# EAGLE schematic usblighteagle (EAGLE 6.5.0)
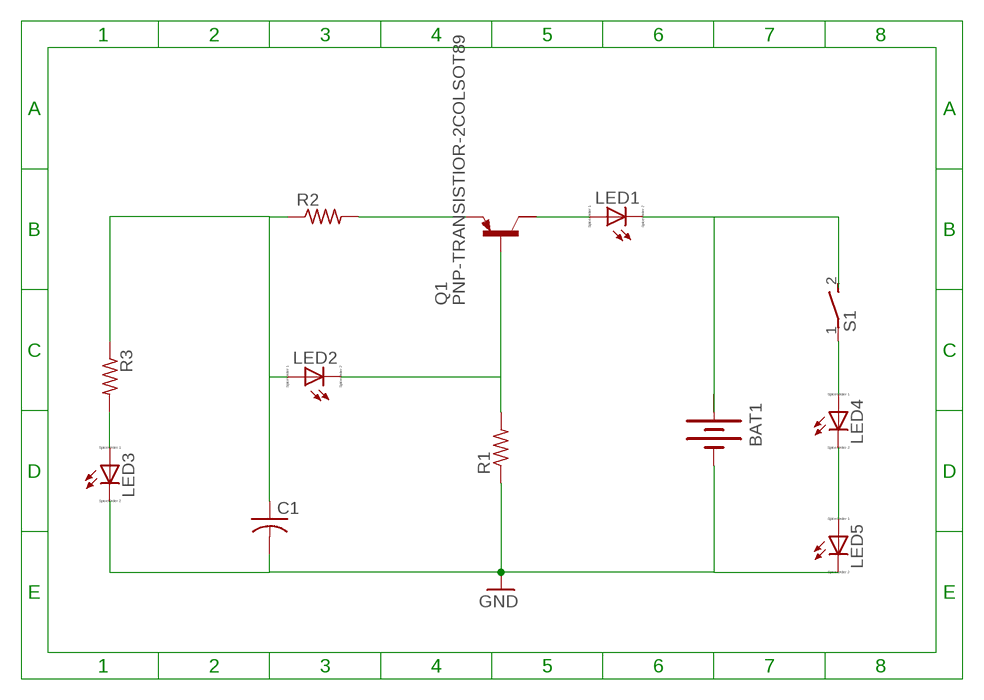
[diagram p0: schematic, sheet 1]

## Parts
BAT1  BATTERY  [BATTERY]
C1  C-US025-024X044  [C025-024X044]
LED1  LED_E  [LED_1206]
LED2  LED_E  [LED_1206]
LED3  LED_E  [LED_1206]
LED4  LED_E  [LED_1206]
LED5  LED_E  [LED_1206]
Q1  PNP-TRANSISTIOR-2COLSOT89  [SOT89]
R1  R-US_0204/2V  [0204V]
R2  R-US_0204/2V  [0204V]
R3  R-US_0204/2V  [0204V]
S1  DS01E  [DS-01]

## Nets
GND: BAT1.- C1.2 LED3.C LED5.C R1.1
N$1: Q1.3(E) R2.2
N$2: LED1.A Q1.2(C)
N$3: BAT1.+@1(+) LED1.C
N$4: LED4.A S1.1
N$5: LED4.C LED5.A
N$6: LED2.C Q1.1(B) R1.2
N$7: C1.1 LED2.A R2.1 R3.1
N$9: LED3.A R3.2
Unconnected: Q1.2@1(C/) S1.2

## Power pins joined to a net without a drawn wire
+: BAT1.+

## Library data of the parts
BAT1 = special:BATTERY: BATTERY
C1 = resistor:C-US: CAPACITOR, American symbol
LED1-LED5 = eagle-ltspice:LED_E: LED Source: http://www.osram.convergy.de Source: www.luxeon.com Source: www.kingbright.com; SPICEMODEL: NONE; SPICEPREFIX: D; SPICETYPE: diode
Q1 = semicon-smd-ipc:PNP-TRANSISTIOR-2COL: PNP TRANSISTOR 2 colletor pins
R1-R3 = resistor:R-US_: RESISTOR, American symbol
S1 = switch-dil:DS01E: DIL/CODE SWITCH; OC_FARNELL: unknown; OC_NEWARK: unknown